# EAGLE design midi_to_cv (EAGLE 7.1.0)
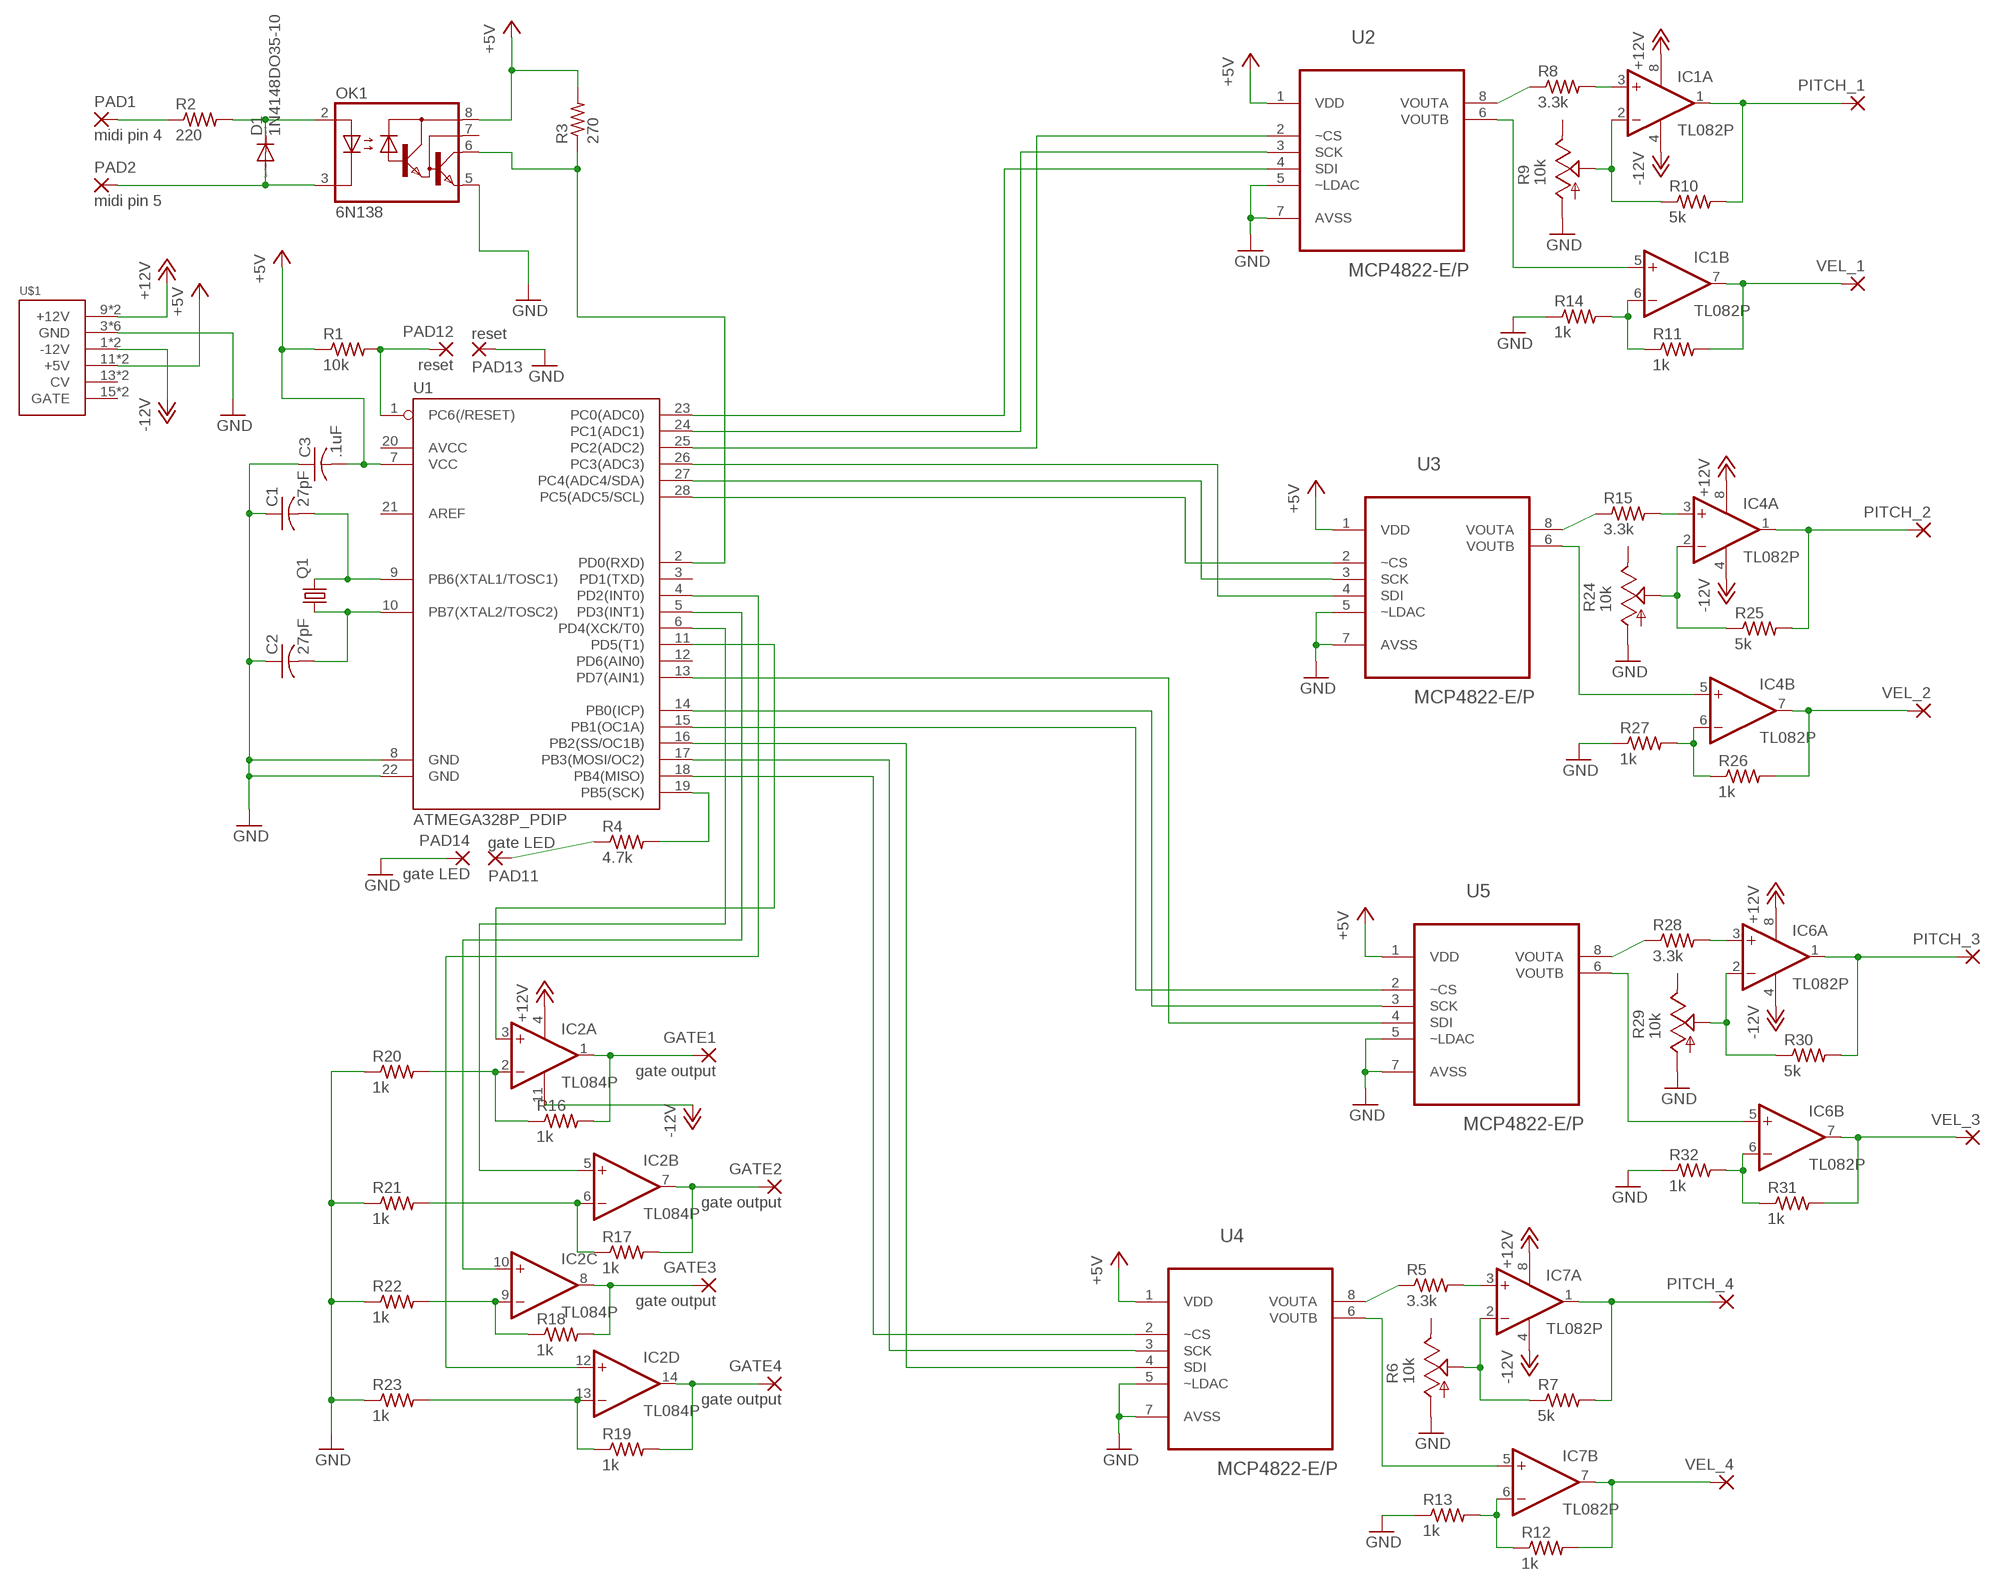
[diagram p0: schematic, sheet 1]

## Parts
C1  27pF  C-US025-040X050  [C025-040X050]
C2  27pF  C-US025-040X050  [C025-040X050]
C3  .1uF  C-US025-040X050  [C025-040X050]
D1  1N4148DO35-10  [DO35-10]
GATE1  gate output  2,54/0,9  [2,54/0,9]
GATE2  gate output  2,54/0,9  [2,54/0,9]
GATE3  gate output  2,54/0,9  [2,54/0,9]
GATE4  gate output  2,54/0,9  [2,54/0,9]
IC1  TL082P  [DIL08]
IC2  TL084P  [DIL14]
IC4  TL082P  [DIL08]
IC6  TL082P  [DIL08]
IC7  TL082P  [DIL08]
OK1  6N138  [DIL08]
PAD1  midi pin 4  2,54/0,9  [2,54/0,9]
PAD2  midi pin 5  2,54/0,9  [2,54/0,9]
PAD11  gate LED  2,54/0,9  [2,54/0,9]
PAD12  reset  2,54/0,9  [2,54/0,9]
PAD13  reset  2,54/0,9  [2,54/0,9]
PAD14  gate LED  2,54/0,9  [2,54/0,9]
PITCH_1  2,54/0,9  [2,54/0,9]
PITCH_2  2,54/0,9  [2,54/0,9]
PITCH_3  2,54/0,9  [2,54/0,9]
PITCH_4  2,54/0,9  [2,54/0,9]
Q1  CRYSTALHC49U-V  [HC49U-V]
R1  10k  R-US_0207/10  [0207/10]
R2  220  R-US_0207/10  [0207/10]
R3  270  R-US_0207/10  [0207/10]
R4  4.7k  R-US_0207/10  [0207/10]
R5  3.3k  R-US_0207/10  [0207/10]
R6  10k  TRIM_US-B64W  [B64W]
R7  5k  R-US_0207/10  [0207/10]
R8  3.3k  R-US_0207/10  [0207/10]
R9  10k  TRIM_US-B64W  [B64W]
R10  5k  R-US_0207/10  [0207/10]
R11  1k  R-US_0207/10  [0207/10]
R12  1k  R-US_0207/10  [0207/10]
R13  1k  R-US_0207/10  [0207/10]
R14  1k  R-US_0207/10  [0207/10]
R15  3.3k  R-US_0207/10  [0207/10]
R16  1k  R-US_0207/10  [0207/10]
R17  1k  R-US_0207/10  [0207/10]
R18  1k  R-US_0207/10  [0207/10]
R19  1k  R-US_0207/10  [0207/10]
R20  1k  R-US_0207/10  [0207/10]
R21  1k  R-US_0207/10  [0207/10]
R22  1k  R-US_0207/10  [0207/10]
R23  1k  R-US_0207/10  [0207/10]
R24  10k  TRIM_US-B64W  [B64W]
R25  5k  R-US_0207/10  [0207/10]
R26  1k  R-US_0207/10  [0207/10]
R27  1k  R-US_0207/10  [0207/10]
R28  3.3k  R-US_0207/10  [0207/10]
R29  10k  TRIM_US-B64W  [B64W]
R30  5k  R-US_0207/10  [0207/10]
R31  1k  R-US_0207/10  [0207/10]
R32  1k  R-US_0207/10  [0207/10]
U1  ATMEGA328P_PDIP  [DIL28-3]
U2  MCP4822-E/P  [DIP254P762X432-8]
U3  MCP4822-E/P  [DIP254P762X432-8]
U4  MCP4822-E/P  [DIP254P762X432-8]
U5  MCP4822-E/P  [DIP254P762X432-8]
U$1  POWER  [POWER_16]
VEL_1  2,54/0,9  [2,54/0,9]
VEL_2  2,54/0,9  [2,54/0,9]
VEL_3  2,54/0,9  [2,54/0,9]
VEL_4  2,54/0,9  [2,54/0,9]

## Nets
+5V: C3.2 OK1.8(VCC) R1.1 R3.2 U1.7(VCC) U2.1(VDD) U3.1(VDD) U4.1(VDD) U5.1(VDD) U$1.11(+5V) U$1.12(+5V)
+12V: IC1.8(P:V+) IC2.4(P:V+) IC4.8(P:V+) IC6.8(P:V+) IC7.8(P:V+) U$1.9(+12V) U$1.10(+12V)
-12V: IC1.4(P:V-) IC2.11(P:V-) IC4.4(P:V-) IC6.4(P:V-) IC7.4(P:V-) U$1.1(-12V) U$1.2(-12V)
GND: C1.1 C2.1 C3.1 OK1.5(GND) PAD13.1(P) PAD14.1(P) R6.A R9.A R13.1 R14.1 R20.1 R21.1 R22.1 R23.1 R24.A R27.1 R29.A R32.1 U1.8(GND) U1.22(GND) U2.5(~LDAC) U2.7(AVSS) U3.5(~LDAC) U3.7(AVSS) U4.5(~LDAC) U4.7(AVSS) U5.5(~LDAC) U5.7(AVSS) U$1.3(GND) U$1.4(GND) U$1.5(GND) U$1.6(GND) U$1.7(GND) U$1.8(GND)
N$1: PAD12.1(P) R1.2 U1.1(PC6(/RESET))
N$2: R5.1 U4.8(VOUTA)
N$3: D1.A OK1.3(C) PAD2.1(P)
N$4: C1.2 Q1.2 U1.9(PB6(XTAL1/TOSC1))
N$5: C2.2 Q1.1 U1.10(PB7(XTAL2/TOSC2))
N$6: IC7.3(A:+IN) R5.2
N$7: D1.C OK1.2(A) R2.2
N$8: PAD1.1(P) R2.1
N$9: IC7.1(A:OUT) PITCH_4.1(P) R7.2
N$10: R4.2 U1.19(PB5(SCK))
N$11: PAD11.1(P) R4.1
N$12: IC7.2(A:-IN) R6.S R7.1
N$13: R8.1 U2.8(VOUTA)
N$14: U1.17(PB3(MOSI/OC2)) U4.3(SCK)
N$15: U1.16(PB2(SS/OC1B)) U4.4(SDI)
N$16: IC1.3(A:+IN) R8.2
N$17: IC1.1(A:OUT) PITCH_1.1(P) R10.2
N$18: IC1.2(A:-IN) R9.S R10.1
N$19: IC7.7(B:OUT) R12.2 VEL_4.1(P)
N$20: IC7.6(B:-IN) R12.1 R13.2
N$21: IC1.7(B:OUT) R11.2 VEL_1.1(P)
N$22: IC1.6(B:-IN) R11.1 R14.2
N$24: IC1.5(B:+IN) U2.6(VOUTB)
N$25: R15.1 U3.8(VOUTA)
N$26: IC4.3(A:+IN) R15.2
N$27: U1.18(PB4(MISO)) U4.2(~CS)
N$28: U1.13(PD7(AIN1)) U5.4(SDI)
N$29: U1.15(PB1(OC1A)) U5.2(~CS)
N$30: OK1.6(VO) R3.1 U1.2(PD0(RXD))
N$32: IC2.3(A:+IN) U1.11(PD5(T1))
N$33: IC2.5(B:+IN) U1.6(PD4(XCK/T0))
N$35: GATE1.1(P) IC2.1(A:OUT) R16.2
N$36: GATE2.1(P) IC2.7(B:OUT) R17.2
N$37: GATE3.1(P) IC2.8(C:OUT) R18.2
N$38: GATE4.1(P) IC2.14(D:OUT) R19.2
N$39: IC2.2(A:-IN) R16.1 R20.2
N$40: IC2.13(D:-IN) R19.1 R23.2
N$41: IC2.9(C:-IN) R18.1 R22.2
N$42: IC2.6(B:-IN) R17.1 R21.2
N$45: IC2.10(C:+IN) U1.5(PD3(INT1))
N$46: IC2.12(D:+IN) U1.4(PD2(INT0))
N$49: IC4.1(A:OUT) PITCH_2.1(P) R25.2
N$50: IC4.2(A:-IN) R24.S R25.1
N$51: IC7.5(B:+IN) U4.6(VOUTB)
N$52: IC4.7(B:OUT) R26.2 VEL_2.1(P)
N$53: IC4.6(B:-IN) R26.1 R27.2
N$54: IC4.5(B:+IN) U3.6(VOUTB)
N$55: R28.1 U5.8(VOUTA)
N$56: IC6.3(A:+IN) R28.2
N$57: IC6.1(A:OUT) PITCH_3.1(P) R30.2
N$58: IC6.2(A:-IN) R29.S R30.1
N$59: IC6.7(B:OUT) R31.2 VEL_3.1(P)
N$60: IC6.6(B:-IN) R31.1 R32.2
N$61: IC6.5(B:+IN) U5.6(VOUTB)
N$62: U1.23(PC0(ADC0)) U2.4(SDI)
N$63: U1.24(PC1(ADC1)) U2.3(SCK)
N$64: U1.25(PC2(ADC2)) U2.2(~CS)
N$65: U1.26(PC3(ADC3)) U3.4(SDI)
N$66: U1.27(PC4(ADC4/SDA)) U3.3(SCK)
N$67: U1.28(PC5(ADC5/SCL)) U3.2(~CS)
N$68: U1.14(PB0(ICP)) U5.3(SCK)
Unconnected: OK1.7(VB) R6.E R9.E R24.E R29.E U1.3(PD1(TXD)) U1.12(PD6(AIN0)) U1.20(AVCC) U1.21(AREF) U$1.13(CV) U$1.14(CV) U$1.15(GATE) U$1.16(GATE)

## Library data of the parts
C1-C3 = rcl:C-US: CAPACITOR, American symbol
D1 = diode:1N4148: DIODE high speed (Philips)
GATE1-GATE4 PAD1 PAD2 PAD11-PAD14 PITCH_1-PITCH_4 VEL_1-VEL_4 = wirepad:2,54/0,9: THROUGH-HOLE PAD
IC1 IC4 IC6 IC7 = linear:TL082: OP AMP Data sheet <http://www.ti.com/lit/ds/symlink/tl084a . pdf>; DATA_SHEET: <a href="http://www.ti.com/lit/ds/symlink/tl084a.pdf"> Data sheet </a>
IC2 = linear:TL084: OP AMP
OK1 = optocoupler:6N138: MOTOROLA OPTO COUPLER; MF: VISHAY/TELEFUNKEN; MPN: 6N138; OC_FARNELL: 9860150; OC_NEWARK: 35K5294
Q1 = crystal:CRYSTAL: CRYSTAL; OC_FARNELL: 1666969; OC_NEWARK: unknown
R1-R5 R7 R8 R10-R23 R25-R28 R30-R32 = rcl:R-US_: RESISTOR, American symbol
R6 R9 R24 R29 = pot:TRIM_US-: POTENTIOMETER
U1 = SparkFun-DigitalIC:ATMEGA328P_PDIP: uC used in the Arduino 32kb flash, 1k EEPROM, 2k SRAM This is the through-hole version of this chip.
U2-U5 = MCP4822:MCP4822-E/P: DAC; MPN: MCP4822-E/P; OC_FARNELL: 1439413; OC_NEWARK: 11M1705; PACKAGE: DIP-8; SUPPLIER: Microchip
U$1 = eurorack:POWER

## Board
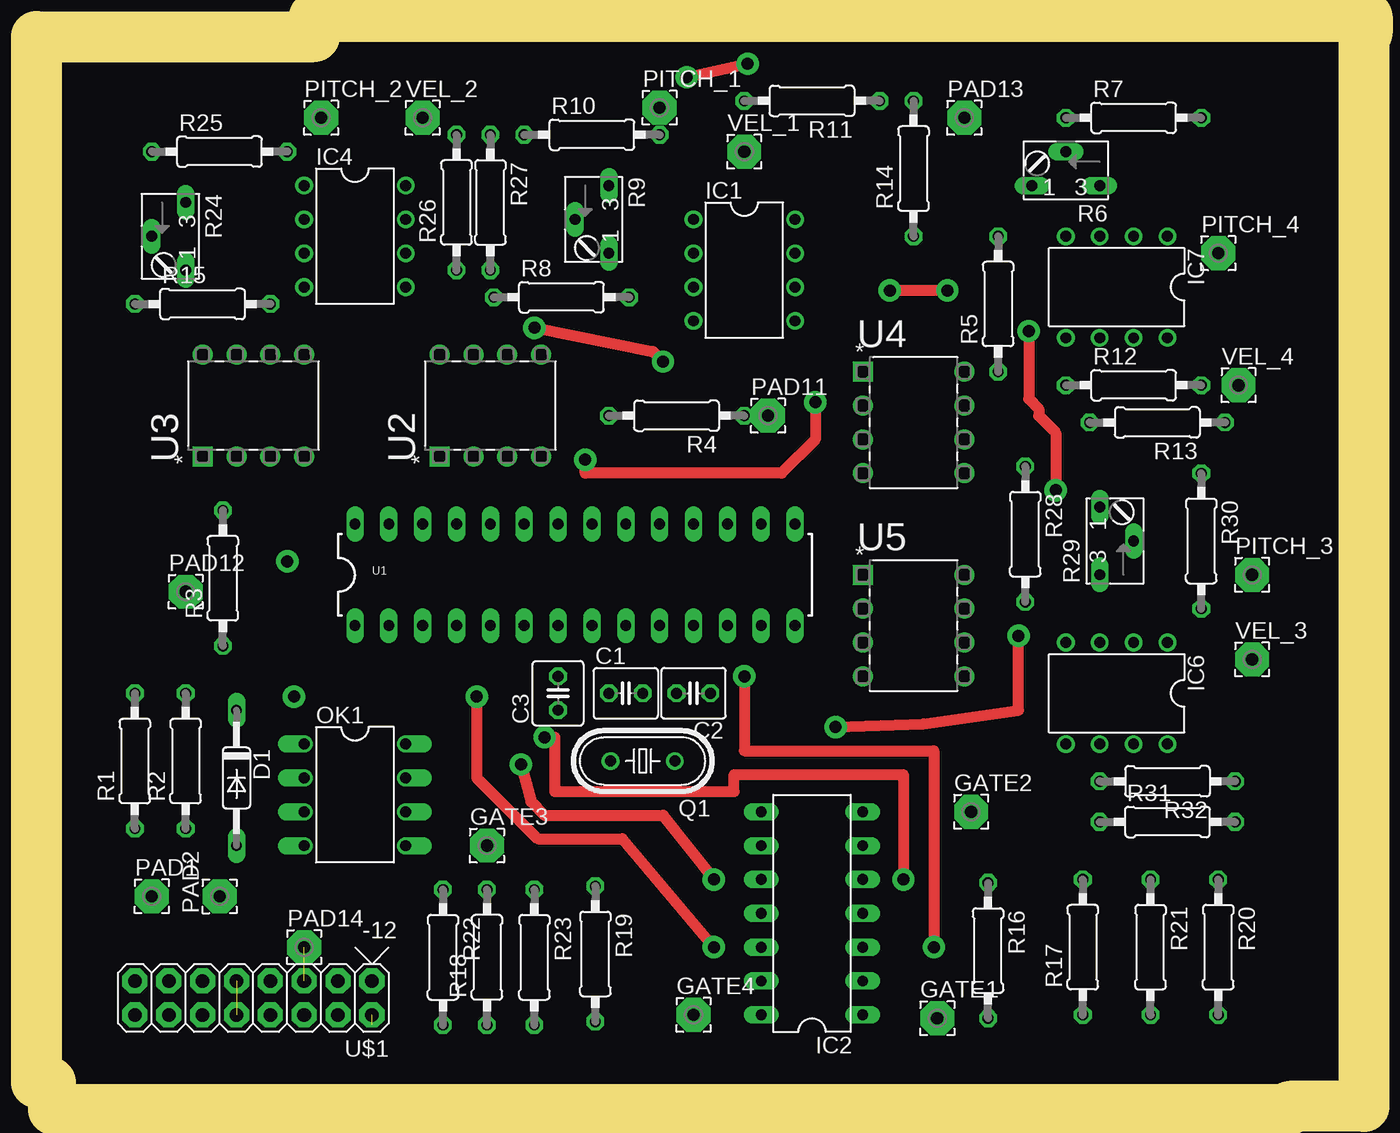
[diagram p1: board, top side]
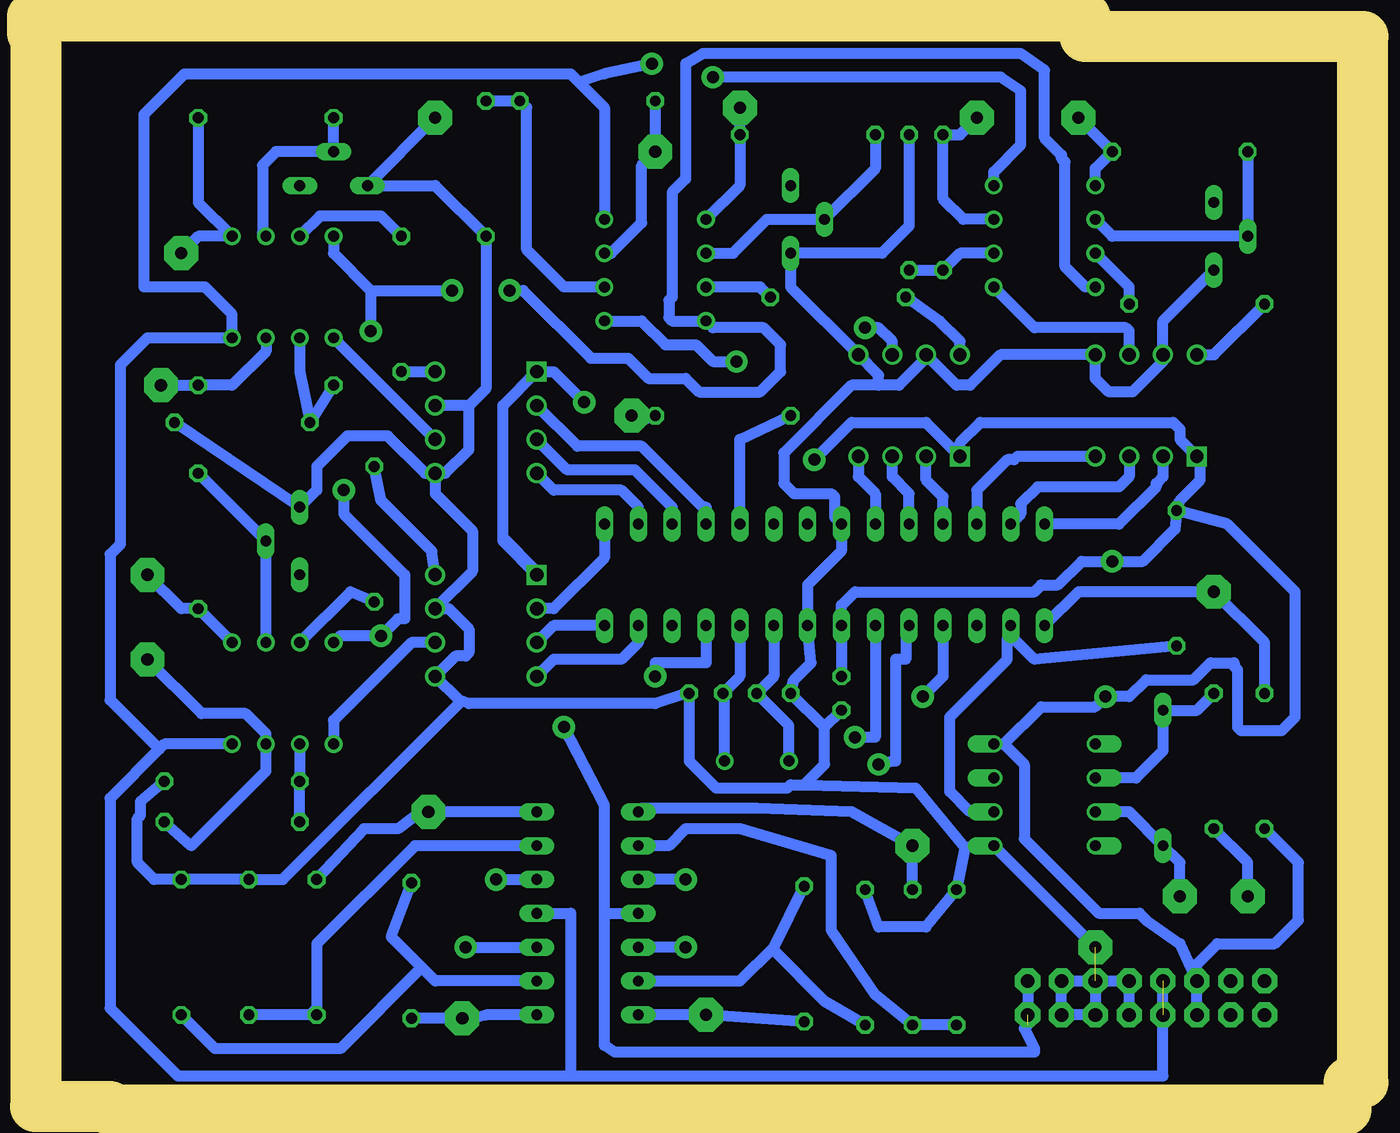
[diagram p2: board, bottom side, seen from below]

Size 100 x 80 mm. Coordinates in mm from the lower left corner, seen from the top.
Outline: 0,0 100,0 100,80 0,80 0,0
Copper layers (1*16): Top 0.035mm / dielectric 1.5mm / Bottom 0.035mm
Design rules "default *": minimum track width 32mil, minimum drill 24mil, track to track 16mil, track to pad 16mil, pad to pad 16mil, via to via 8mil, smd to smd 8mil, copper to edge 40mil, drill to drill 8mil, minimum pad ring 10mil, minimum via ring 8mil, stop-mask expansion 4mil, vias tented up to drill 0mil, thermal gap 10mil
Milling: 12 lines

### Footprints (pad centres in the part's own frame; a part is rotated, then mirrored left to right if it is on the bottom)
C025-040X050 = drill 0.813 octagon: 1 -1.27,0; 2 1.27,0
DO35-10 = drill 0.813 long: A 5.08,0; C -5.08,0
2,54/0,9 = drill 0.914 pad 2.54 octagon: 1 0,0
DIL08 = drill 0.813 pad 1.27: 1 -3.81,-3.81; 2 -1.27,-3.81; 3 1.27,-3.81; 4 3.81,-3.81; 5 3.81,3.81; 6 1.27,3.81; 7 -1.27,3.81; 8 -3.81,3.81
DIL14 = drill 0.813 long: 1 -7.62,-3.81; 2 -5.08,-3.81; 3 -2.54,-3.81; 4 0,-3.81; 5 2.54,-3.81; 6 5.08,-3.81; 7 7.62,-3.81; 8 7.62,3.81; 9 5.08,3.81; 10 2.54,3.81; 11 0,3.81; 12 -2.54,3.81; 13 -5.08,3.81; 14 -7.62,3.81
DIL08' = drill 0.813 offset: 1 -3.81,-3.81; 2 -1.27,-3.81; 3 1.27,-3.81; 4 3.81,-3.81; 5 3.81,3.81; 6 1.27,3.81; 7 -1.27,3.81; 8 -3.81,3.81
HC49U-V = drill 0.813: 1 -2.413,0; 2 2.413,0
0207/10 = drill 0.813 octagon: 1 -5.08,0; 2 5.08,0
B64W = drill 0.813 long: A 2.54,0; E -2.54,0; S 0,-2.54
DIL28-3 = drill 0.813 long: 1 -16.51,-3.81; 2 -13.97,-3.81; 3 -11.43,-3.81; 4 -8.89,-3.81; 5 -6.35,-3.81; 6 -3.81,-3.81; 7 -1.27,-3.81; 8 1.27,-3.81; 9 3.81,-3.81; 10 6.35,-3.81; 11 8.89,-3.81; 12 11.43,-3.81; 13 13.97,-3.81; 14 16.51,-3.81; 15 16.51,3.81; 16 13.97,3.81; 17 11.43,3.81; 18 8.89,3.81; 19 6.35,3.81; 20 3.81,3.81; 21 1.27,3.81; 22 -1.27,3.81; 23 -3.81,3.81; 24 -6.35,3.81; 25 -8.89,3.81; 26 -11.43,3.81; 27 -13.97,3.81; 28 -16.51,3.81
DIP254P762X432-8 = drill 0.991 square: 1 -7.62,7.62 | drill 0.991: 2 -7.62,5.08; 3 -7.62,2.54; 4 -7.62,0; 5 0,0; 6 0,2.54; 7 0,5.08; 8 0,7.62
POWER_16 = drill 1.016 pad 1.88 octagon: 1 -6.35,-1.27; 2 -6.35,1.27; 3 -3.81,-1.27; 4 -3.81,1.27; 5 -1.27,-1.27; 6 -1.27,1.27; 7 1.27,-1.27; 8 1.27,1.27; 9 3.81,-1.27; 10 3.81,1.27; 11 6.35,-1.27; 12 6.35,1.27; 13 8.89,-1.27; 14 8.89,1.27; 15 11.43,-1.27; 16 11.43,1.27

### Placement (x,y rotation side)
C1  44.45,30.48 0 top
C2  49.53,30.48 180 top
C3  39.37,30.48 90 top
D1  15.24,24.13 270 top
GATE1  67.82,6.1 0 top
GATE2  70.36,21.59 0 top
GATE3  34.04,19.05 0 top
GATE4  49.53,6.35 0 top
IC1  53.34,62.23 270 top
IC2  58.42,13.97 90 top
IC4  24.13,64.77 270 top
IC6  81.28,30.48 180 top
IC7  81.28,60.96 180 top
OK1  6N138  [DIL08']  24.13,22.86 270 top
PAD1  8.89,15.24 0 top
PAD2  13.97,15.24 90 top
PAD11  55.12,51.31 0 top
PAD12  11.43,38.1 0 top
PAD13  69.85,73.66 0 top
PAD14  20.32,11.43 0 top
PITCH_1  46.99,74.42 0 top
PITCH_2  21.59,73.66 0 top
PITCH_3  91.44,39.37 0 top
PITCH_4  88.9,63.5 0 top
Q1  45.72,25.4 180 top
R1  7.62,25.4 90 top
R2  11.43,25.4 90 top
R3  14.22,39.12 90 top
R4  48.26,51.31 180 top
R5  72.39,59.69 90 top
R6  77.47,68.58 180 top
R7  82.55,73.66 0 top
R8  39.62,60.2 0 top
R9  43.18,66.04 270 top
R10  41.91,72.39 0 top
R11  58.42,74.93 180 top
R12  82.55,53.59 0 top
R13  84.33,50.8 180 top
R14  66.04,69.85 90 top
R15  12.7,59.69 0 top
R16  71.63,11.18 270 top
R17  78.74,11.43 90 top
R18  34.04,10.67 90 top
R19  42.16,10.92 270 top
R20  88.9,11.43 270 top
R21  83.82,11.43 270 top
R22  30.73,10.67 270 top
R23  37.59,10.67 270 top
R24  11.43,64.77 270 top
R25  13.97,71.12 0 top
R26  31.75,67.31 90 top
R27  34.29,67.31 270 top
R28  74.42,42.42 270 top
R29  80.01,41.91 90 top
R30  87.63,41.91 270 top
R31  85.09,20.83 0 top
R32  85.09,23.88 180 top
U1  40.64,39.37 0 top
U2  38.1,55.88 90 top
U3  20.32,55.88 90 top
U4  69.85,46.99 0 top
U5  69.85,31.75 0 top
U$1  19.05,7.62 180 top
VEL_1  53.34,71.12 0 top
VEL_2  29.21,73.66 0 top
VEL_3  91.44,33.02 0 top
VEL_4  90.42,53.59 0 top

### Tracks (layer width: path | path; a pad name or v marks a point on that pad's centre or on a via)
+5V  (via drill 0.9 pad 1.68)
  Top 0.813: v58.67,52.32 58.67,49.53 56.13,46.99 41.4,46.99 v41.4,48.01
  Bottom 0.813: U$1.12 U$1.11 | U$1.11 12.7,10.16 11.18,11.68 6.86,11.68 5.08,13.46 5.08,17.78 R1.1 | OK1.8 27.18,26.67 | 27.18,26.67 25.65,25.15 25.65,19.56 20.07,13.97 17.02,13.97 16.51,13.46 13.97,11.68 U$1.11 | R3.2 13.97,44.96 12.45,46.48 12.45,48.01 U3.1 13.97,49.53 13.97,50.29 14.48,50.8 28.96,50.8 30.48,49.28 U2.1 33.02,50.8 38.61,50.8 v41.4,48.01 | C3.2 U1.7 39.37,37.08 38.35,38.1 24.89,38.1 24.38,38.61 23.11,38.61 21.34,40.39 v19.05,40.39 16.76,40.39 14.35,42.8 R3.2 | 64.77,42.16 64.77,41.91 U5.1 62.23,39.62 64.77,42.16 | 27.18,26.67 24.38,29.46 20.32,29.46 v19.56,30.23 17.78,30.23 16.51,31.5 12.95,31.5 11.68,32.77 9.91,32.77 9.91,32.51 9.65,32.26 9.65,27.94 9.4,27.69 6.35,27.69 5.33,28.7 5.33,38.1 10.41,43.18 R3.2 | 64.77,42.16 64.77,52.07 U4.1 60.96,54.61 v58.67,52.32
+12V  (via drill 0.9 pad 1.68)  (1 unrouted)
  Top 0.813: v49.02,76.71 v53.59,77.72
  Bottom 0.813: IC2.4 59.69,13.97 59.69,1.78 | 59.69,1.78 15.24,1.78 U$1.9 | IC4.8 27.94,69.6 25.91,71.63 25.91,75.69 27.43,76.71 v49.02,76.71 | 59.05,76.33 59.69,76.96 88.65,76.96 91.69,73.91 91.69,60.96 87.12,60.96 85.09,58.93 IC7.8 91.44,57.15 93.47,55.12 93.47,41.66 94.23,40.89 94.23,29.97 90.55,26.29 | 59.05,76.33 57.15,74.42 IC1.8 | v53.59,77.72 57.15,76.96 59.05,76.33 | IC6.8 90.17,26.67 90.55,26.29 | 90.55,26.29 94.23,22.61 94.23,6.86 89.15,1.78 59.69,1.78
-12V  (via drill 0.9 pad 1.68)  (1 unrouted)
  Top 0.813: v68.58,60.71 v64.26,60.71 | v74.68,57.66 74.68,52.58 75.44,51.82 75.44,51.31 76.71,50.04 v76.71,45.72 | v60.2,27.94 66.8,28.19 73.91,29.21 v73.91,34.8
  Bottom 0.813: 57.15,13.97 IC2.11 | U$1.1 25.4,5.59 25.65,5.33 24.89,3.81 24.89,3.56 56.39,3.56 57.15,4.06 57.15,13.97 | IC4.4 21.08,60.96 22.61,62.48 22.61,70.36 22.86,70.61 22.86,70.87 24.13,72.14 24.13,77.22 25.91,78.49 49.78,78.49 51.05,77.72 51.05,69.09 52.07,68.07 52.07,60.2 52.32,59.94 52.32,58.67 52.07,58.42 IC1.4 49.02,57.91 45.21,57.91 43.94,56.64 43.94,54.61 45.47,53.09 50.04,53.09 51.05,54.1 53.85,54.1 55.37,55.63 58.17,55.63 63.25,60.71 v64.26,60.71 | IC7.4 77.47,63.5 74.68,60.71 | 74.68,60.71 v68.58,60.71 | 74.68,60.71 v74.68,57.66 | v76.71,45.72 76.71,43.94 72.14,39.37 72.14,36.07 72.64,36.07 v73.91,34.8 76.96,34.8 IC6.4 | 57.15,13.97 57.15,22.1 v60.2,27.94
GND  (1 unrouted)
  Bottom 0.813: U$1.8 U$1.7 U$1.3 U$1.4 U$1.6 U$1.5 | PAD14.1 OK1.5 29.21,19.05 30.1,18.92 | 30.1,18.92 R22.1 33.02,12.95 36.58,12.95 R23.1 | PAD13.1 R6.A 69.85,68.58 R14.1 66.04,53.34 67.31,52.07 | 42.16,23.62 43.18,23.62 43.43,23.37 48.77,23.37 50.8,25.4 C2.1 51.05,30.48 53.34,29.72 67.31,29.72 68.07,29.97 | 42.16,23.62 40.64,25.15 40.64,27.94 | 40.64,27.94 C3.1 | 40.64,27.94 C1.1 42.93,31.5 41.66,32.77 U1.8 41.91,38.61 39.37,41.15 U1.22 39.88,43.69 39.88,45.21 40.13,45.47 42.93,45.47 43.69,46.23 43.69,48.51 38.61,53.59 36.58,53.59 | R24.A 15.24,58.42 U3.7 15.24,55.37 17.53,53.09 19.3,53.09 20.32,54.1 U3.5 27.43,55.88 29.72,53.59 30.73,53.59 U2.7 33.02,55.63 35.05,53.59 36.58,53.59 | R27.1 34.29,65.53 36.32,63.5 R9.A 43.18,60.96 U2.5 36.58,54.36 36.58,53.59 | 67.31,52.07 U4.7 | 68.07,29.97 67.94,29.84 81.28,16.51 R21.1 R20.1 90.93,16.51 92.2,17.78 92.2,21.08 91.95,21.34 91.95,22.35 R32.1 | 68.07,29.97 U5.5 68.33,33.27 67.56,33.27 67.31,33.53 67.31,35.31 68.83,36.83 U5.7 67.06,39.62 67.06,42.67 69.85,45.47 U4.5 | U4.5 69.09,46.99 67.31,48.77 67.31,52.07 | U4.5 70.61,46.99 73.41,49.78 76.45,49.78 78.74,47.5 78.74,45.72 R29.A R13.1 | 42.16,23.62 33.78,23.37 30.1,18.92
N$1
  Bottom 0.813: R1.2 7.62,34.29 PAD12.1 21.59,38.1 U1.1
N$2
  Bottom 0.813: R5.1 U4.8
N$3
  Bottom 0.813: PAD2.1 13.97,17.78 D1.A 17.78,21.59 OK1.3
N$4
  Bottom 0.813: Q1.2 43.31,28.07 C1.2 44.45,31.75 U1.9
N$5
  Bottom 0.813: Q1.1 48.13,30.35 C2.2 46.99,31.75 U1.10
N$6
  Bottom 0.813: R5.2 73.91,66.29 78.49,66.29 IC7.3
N$7
  Bottom 0.813: OK1.2 17.27,24.13 15.24,26.16 D1.C 12.7,29.21 R2.2
N$8
  Bottom 0.813: PAD1.1 8.89,17.78 R2.1
N$9
  Bottom 0.813: R7.2 87.63,67.31 IC7.1 87.63,64.77 PITCH_4.1
N$10
  Bottom 0.813: U1.19 46.99,49.53 R4.2
N$11
  Bottom 0.813: R4.1 54.61,50.8 PAD11.1
N$12
  Bottom 0.813: IC7.2 82.8,65.02 82.8,70.1 81.79,71.12 R6.S R7.1
N$13
  Bottom 0.813: U2.8 30.48,56.9 32,58.42 R8.1
N$14
  Bottom 0.813: U1.17 52.07,44.45 54.86,47.24 59.94,47.24 U4.3
N$15
  Bottom 0.813: U1.16 54.61,44.45 55.88,45.72 60.96,45.72 U4.4
N$16
  Bottom 0.813: R8.2 45.47,60.96 IC1.3
N$17
  Bottom 0.813: PITCH_1.1 R10.2 46.99,68.58 IC1.1
N$18
  Bottom 0.813: IC1.2 47.5,63.5 44.96,66.04 R9.S 36.83,69.85 R10.1
N$19
  Bottom 0.813: IC7.7 82.55,56.13 85.09,53.59 R12.2 VEL_4.1
N$20
  Bottom 0.813: IC7.6 80.01,54.61 R13.2 R12.1
N$21
  Bottom 0.813: IC1.7 56.64,63.5 54.36,65.79 54.36,70.1 VEL_1.1 R11.2
N$22
  Bottom 0.813: R14.2 R11.1 62.99,74.42 62.99,63.75 60.2,60.96 IC1.6
N$24  (via drill 0.9 pad 1.68)
  Top 0.813: v37.59,57.91 46.48,56.13 v47.24,55.37
  Bottom 0.813: IC1.5 54.36,58.42 52.58,56.64 50.29,56.64 49.02,55.37 v47.24,55.37 | U2.6 35.56,56.9 36.58,57.91 v37.59,57.91
N$25
  Bottom 0.813: U3.8 11.43,55.88 R15.1
N$26
  Bottom 0.813: R15.2 17.78,60.96 IC4.3
N$27
  Bottom 0.813: U1.18 49.53,44.45 49.78,44.45 54.36,49.02 59.18,49.02 U4.2
N$28
  Bottom 0.813: U1.13 54.61,34.29 55.88,33.02 60.96,33.02 U5.4
N$29
  Bottom 0.813: U1.15 57.15,40.64 60.96,36.83 U5.2
N$30
  Bottom 0.813: R3.1 24.89,33.02 26.67,34.8 | 26.67,34.8 U1.2 | OK1.6 29.72,21.59 31.24,23.11 31.24,28.7 26.92,33.02 26.92,34.54 26.67,34.8
N$32  (via drill 0.9 pad 1.68)
  Top 0.813: v53.34,31.75 53.34,26.16 67.56,26.16 v67.56,11.43
  Bottom 0.813: U1.11 49.53,32.77 53.34,32.77 v53.34,31.75 | v67.56,11.43 IC2.3
N$33  (via drill 0.9 pad 1.68)
  Top 0.813: v38.35,27.18 39.12,27.18 39.12,23.11 52.58,23.11 52.58,24.38 65.28,24.38 v65.28,16.51
  Bottom 0.813: U1.6 36.83,27.18 v38.35,27.18 | v65.28,16.51 IC2.5
N$35
  Bottom 0.813: IC2.1 66.04,6.35 66.8,6.1 GATE1.1 R16.2
N$36
  Bottom 0.813: IC2.7 GATE2.1 70.61,21.84 72.64,20.32 75.18,20.32 R17.2
N$37
  Bottom 0.813: R18.2 GATE3.1 38.61,21.59 45.72,21.84 54.36,21.84 IC2.8
N$38
  Bottom 0.813: R19.2 GATE4.1 IC2.14
N$39
  Bottom 0.813: R20.2 86.36,3.81 76.96,3.81 70.87,9.91 | IC2.2 69.85,8.89 70.87,9.91 | 70.87,9.91 73.15,12.19 R16.1
N$40
  Bottom 0.813: R23.2 40.64,7.37 44.45,11.18 44.45,11.43 | 44.45,11.43 R19.1 | IC2.13 46.99,8.89 44.45,11.43
N$41
  Bottom 0.813: R22.2 R18.1 36.83,7.87 40.13,12.7 40.13,18.29 46.99,20.32 51.05,20.32 52.32,19.05 IC2.9
N$42
  Bottom 0.813: R17.1 79.25,6.35 | 79.25,6.35 R21.2 | IC2.6 71.37,19.05 78.74,11.68 78.74,6.86 79.25,6.35
N$45  (via drill 0.9 pad 1.68)
  Top 0.813: v36.58,25.15 37.34,22.35 38.35,21.34 47.24,21.34 v51.05,16.51
  Bottom 0.813: U1.5 34.54,35.56 34.54,33.02 35.31,33.02 35.31,25.4 v36.58,25.15 | v51.05,16.51 IC2.10
N$46  (via drill 0.9 pad 1.68)
  Top 0.813: v33.27,30.23 33.27,24.13 37.85,19.56 44.2,19.56 v51.05,11.43
  Bottom 0.813: U1.4 31.75,31.75 v33.27,30.23 | v51.05,11.43 IC2.12
N$49
  Bottom 0.813: PITCH_2.1 R25.2 20.32,69.85 IC4.1
N$50
  Bottom 0.813: IC4.2 19.05,64.77 R24.S R25.1
N$51
  Bottom 0.813: U4.6 IC7.5
N$52
  Bottom 0.813: VEL_2.1 30.48,72.39 R26.2 31.75,67.56 30.23,66.04 IC4.7
N$53
  Bottom 0.813: IC4.6 30.48,63.5 R26.1 R27.2
N$54
  Bottom 0.813: U3.6 17.78,57.66 18.03,57.91 24.89,57.91 IC4.5
N$55
  Bottom 0.813: U5.8 70.1,41.15 73.91,44.96 R28.1
N$56
  Bottom 0.813: R28.2 76.2,38.1 IC6.3
N$57
  Bottom 0.813: IC6.1 R30.2 88.9,36.83 PITCH_3.1
N$58
  Bottom 0.813: R30.1 R29.S IC6.2
N$59
  Bottom 0.813: R31.2 88.14,19.05 82.55,24.64 IC6.7 82.55,27.43 84.07,28.96 87.38,28.96 VEL_3.1
N$60
  Bottom 0.813: IC6.6 R32.2 R31.1
N$61
  Bottom 0.813: U5.6 71.63,34.29 77.47,28.45 IC6.5
N$62
  Bottom 0.813: U2.4 38.1,46.74 36.83,45.47 U1.23
N$63
  Bottom 0.813: U1.24 34.29,45.47 35.56,46.74 U2.3
N$64
  Bottom 0.813: U1.25 31.75,45.21 33.02,46.48 U2.2
N$65
  Bottom 0.813: U3.4 26.16,48.26 26.42,48.01 26.92,48.01 29.21,45.72 U1.26
N$66
  Bottom 0.813: U3.3 17.78,46.74 18.54,45.97 24.64,45.97 25.91,44.7 25.91,43.94 U1.27
N$67
  Bottom 0.813: U3.2 15.24,46.74 15.75,46.23 15.75,45.97 18.54,43.18 U1.28
N$68
  Bottom 0.813: U1.14 60.96,35.56 U5.3